# EAGLE design ECE_388_Schematic_v3 (EAGLE 9.6.2)
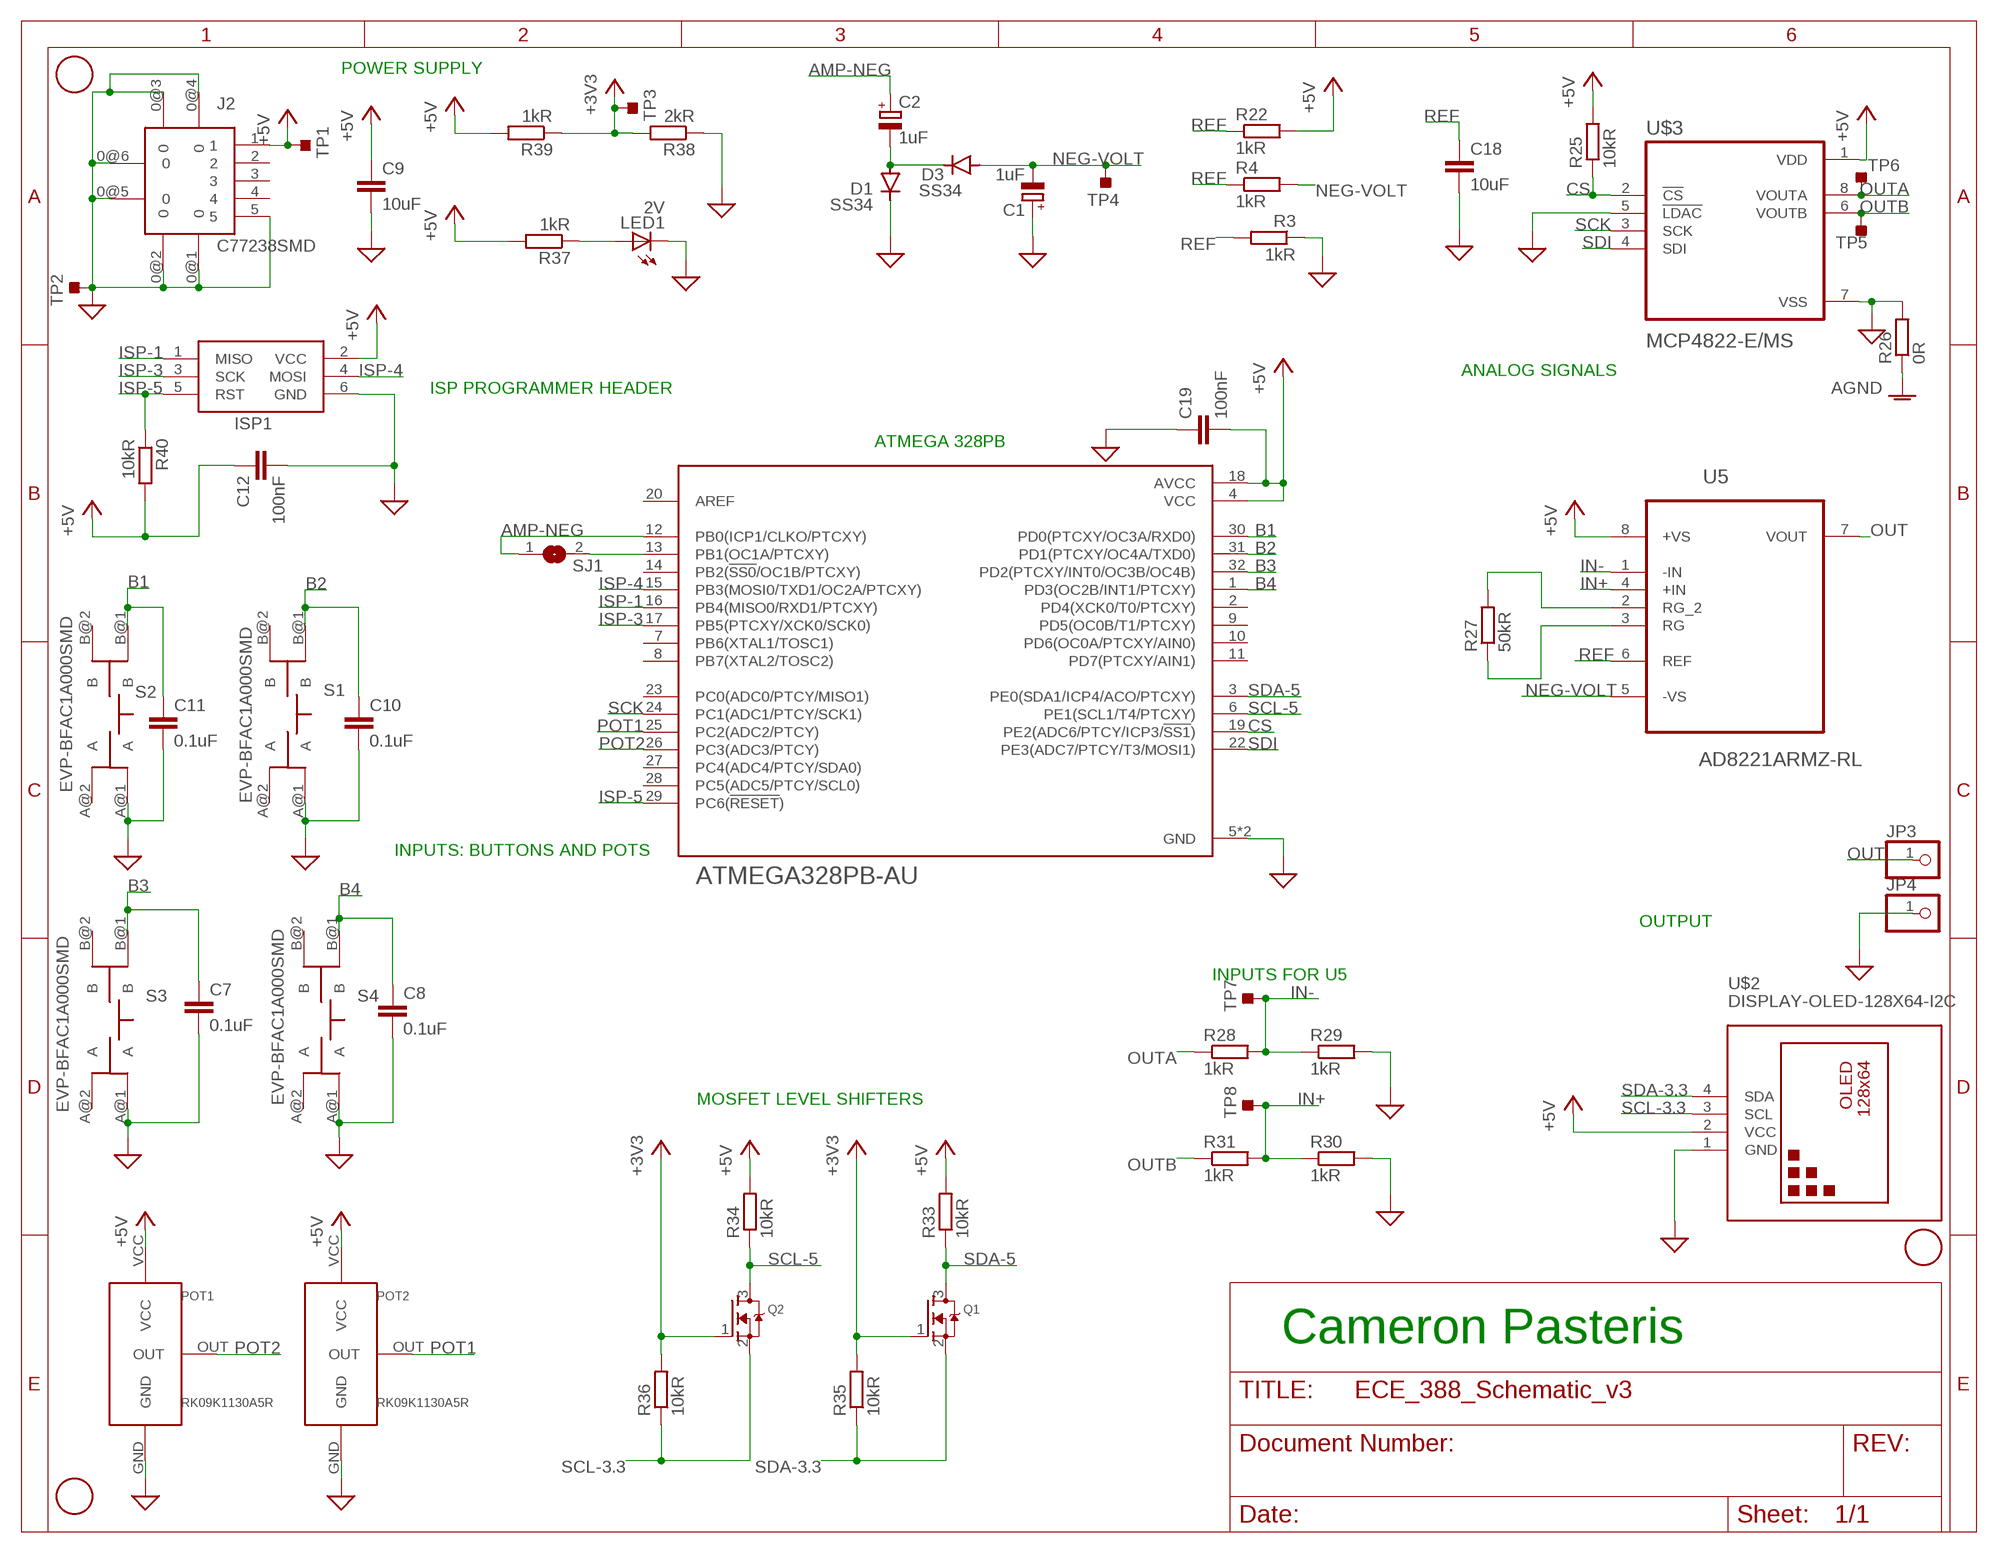
[diagram p0: schematic, sheet 1]

## Parts
C1  1uF  CPOL-EUE2,5-6E  [E2,5-6E]
C2  1uF  CPOL-EUE2,5-6E  [E2,5-6E]
C7  0.1uF  C-EUC0805  [C0805]
C8  0.1uF  C-EUC0805  [C0805]
C9  10uF  C-EUC0805  [C0805]
C10  0.1uF  C-EUC0805  [C0805]
C11  0.1uF  C-EUC0805  [C0805]
C12  100nF  C-EUC0805  [C0805]
C18  10uF  C-EUC0805  [C0805]
C19  100nF  C-EUC0805  [C0805]
D1  SS34  DIODE-DO-214AC  [DO-214AC]
D3  SS34  DIODE-DO-214AC  [DO-214AC]
F1  FIDUCIAL  [FIDUCIAL_1MM]
F2  FIDUCIAL  [FIDUCIAL_1MM]
F3  FIDUCIAL  [FIDUCIAL_1MM]
ISP1  AVRISP-6  [AVRISP]
J2  C77238SMD  [C77238]
JP3  PINHD-1X1  [1X01]
JP4  PINHD-1X1  [1X01]
LED1  2V  LEDCHIP-LED0805  [CHIP-LED0805]
POT1  RK09K1130A5R  [RK09K1130A5R]
POT2  RK09K1130A5R  [RK09K1130A5R]
Q1  MOSFET-NREFLOW  [SOT23]
Q2  MOSFET-NREFLOW  [SOT23]
R3  1kR  R-EU_R0805  [R0805]
R4  1kR  R-EU_R0805  [R0805]
R22  1kR  R-EU_R0805  [R0805]
R25  10kR  R-EU_R0805  [R0805]
R26  0R  R-EU_R0805  [R0805]
R27  50kR  R-EU_R0805  [R0805]
R28  1kR  R-EU_R0805  [R0805]
R29  1kR  R-EU_R0805  [R0805]
R30  1kR  R-EU_R0805  [R0805]
R31  1kR  R-EU_R0805  [R0805]
R33  10kR  R-EU_R0805  [R0805]
R34  10kR  R-EU_R0805  [R0805]
R35  10kR  R-EU_R0805  [R0805]
R36  10kR  R-EU_R0805  [R0805]
R37  1kR  R-EU_R0805  [R0805]
R38  2kR  R-EU_R0805  [R0805]
R39  1kR  R-EU_R0805  [R0805]
R40  10kR  R-EU_R0805  [R0805]
S1  EVP-BFAC1A000SMD  [EVP-BFAC1A000]
S2  EVP-BFAC1A000SMD  [EVP-BFAC1A000]
S3  EVP-BFAC1A000SMD  [EVP-BFAC1A000]
S4  EVP-BFAC1A000SMD  [EVP-BFAC1A000]
SJ1  SJ  [SJ]
TP1  TESTPOINT_TPS-PAD-036  [TESTPOINT_PAD-036]
TP2  TESTPOINT_TPS-PAD-036  [TESTPOINT_PAD-036]
TP3  TESTPOINT_TPS-PAD-036  [TESTPOINT_PAD-036]
TP4  TESTPOINT_TPS-PAD-036  [TESTPOINT_PAD-036]
TP5  TESTPOINT_TPS-PAD-036  [TESTPOINT_PAD-036]
TP6  TESTPOINT_TPS-PAD-036  [TESTPOINT_PAD-036]
TP7  TESTPOINT_TPS-PAD-036  [TESTPOINT_PAD-036]
TP8  TESTPOINT_TPS-PAD-036  [TESTPOINT_PAD-036]
U1  ATMEGA328PB-AU  [QFP80P900X900X120-32N]
U5  AD8221ARMZ-RL  [SOP65P490X110-8N]
U$2  DISPLAY-OLED-128X64-I2C  [DISPLAY-OLED-128X64-I2C]
U$3  MCP4822-E/MS  [SOP65P490X110-8N]

## Nets
+3V3: Q1.1(G) Q2.1(G) R35.2 R36.2 R38.2 R39.1 TP3.1(TP)
+5V: C9.1 C12.1 C19.2 ISP1.2(VCC) J2.1 POT1.VCC POT2.VCC R22.2 R25.2 R33.2 R34.2 R37.2 R39.2 R40.2 TP1.1(TP) U1.4(VCC) U1.18(AVCC) U5.8(+VS) U$2.2(VCC) U$3.1(VDD)
AGND: R26.1
AMP-NEG: C2.+ SJ1.1 U1.12(PB0(ICP1/CLKO/PTCXY))
B1: C11.1 S2.B@1(B) U1.30(PD0(PTCXY/OC3A/RXD0))
B2: C10.1 S1.B@1(B) U1.31(PD1(PTCXY/OC4A/TXD0))
B3: C7.1 S3.B@1(B) U1.32(PD2(PTCXY/INT0/OC3B/OC4B))
B4: C8.1 S4.B@1(B) U1.1(PD3(OC2B/INT1/PTCXY))
CS: R25.1 U1.19(PE2(ADC6/PTCY/ICP3/!SS1!)) U$3.2(!CS)
GND: C1.+ C7.2 C8.2 C9.2 C10.2 C11.2 C12.2 C18.2 C19.1 D1.C ISP1.6(GND) J2.0@1 J2.0@2 J2.0@3 J2.0@4 J2.0@5 J2.0@6 J2.5 JP4.1 LED1.C POT1.GND POT2.GND R3.1 R26.2 R29.2 R30.2 R38.1 S1.A@1(A) S2.A@1(A) S3.A@1(A) S4.A@1(A) TP2.1(TP) U1.5(GND) U1.21(GND) U$2.1(GND) U$3.5(!LDAC) U$3.7(VSS) ; supply symbol labelled SUP
IN+: R30.1 R31.2 TP8.1(TP) U5.4(+IN)
IN-: R28.2 R29.1 TP7.1(TP) U5.1(-IN)
ISP-1: ISP1.1(MISO) U1.16(PB4(MISO0/RXD1/PTCXY))
ISP-3: ISP1.3(SCK) U1.17(PB5(PTCXY/XCK0/SCK0))
ISP-4: ISP1.4(MOSI) U1.15(PB3(MOSI0/TXD1/OC2A/PTCXY))
ISP-5: ISP1.5(RST) R40.1 U1.29(PC6(!RESET!))
N$1: R27.2 U5.2(RG_2)
N$2: LED1.A R37.1
N$3: R27.1 U5.3(RG)
N$4: C2.- D1.A D3.C
N$5: SJ1.2 U1.13(PB1(OC1A/PTCXY))
NEG-VOLT: C1.- D3.A R4.2 TP4.1(TP) U5.5(-VS)
OUT: JP3.1 U5.7(VOUT)
OUTA: R28.1 TP6.1(TP) U$3.8(VOUTA)
OUTB: R31.1 TP5.1(TP) U$3.6(VOUTB)
POT1: POT2.OUT U1.25(PC2(ADC2/PTCY))
POT2: POT1.OUT U1.26(PC3(ADC3/PTCY))
REF: C18.1 R3.2 R4.1 R22.1 U5.6(REF)
SCK: U1.24(PC1(ADC1/PTCY/SCK1)) U$3.3(SCK)
SCL-3.3: Q2.2(S) R36.1 U$2.3(SCL)
SCL-5: Q2.3(D) R34.1 U1.6(PE1(SCL1/T4/PTCXY))
SDA-3.3: Q1.2(S) R35.1 U$2.4(SDA)
SDA-5: Q1.3(D) R33.1 U1.3(PE0(SDA1/ICP4/ACO/PTCXY))
SDI: U1.22(PE3(ADC7/PTCY/T3/MOSI1)) U$3.4(SDI)
Unconnected: J2.2 J2.3 J2.4 S1.A@2(A) S1.B@2(B) S2.A@2(A) S2.B@2(B) S3.A@2(A) S3.B@2(B) S4.A@2(A) S4.B@2(B) U1.2(PD4(XCK0/T0/PTCXY)) U1.7(PB6(XTAL1/TOSC1)) U1.8(PB7(XTAL2/TOSC2)) U1.9(PD5(OC0B/T1/PTCXY)) U1.10(PD6(OC0A/PTCXY/AIN0)) U1.11(PD7(PTCXY/AIN1)) U1.14(PB2(!SS0!/OC1B/PTCXY)) U1.20(AREF) U1.23(PC0(ADC0/PTCY/MISO1)) U1.27(PC4(ADC4/PTCY/SDA0)) U1.28(PC5(ADC5/PTCY/SCL0))

## Notes on the sheet
- POWER SUPPLY
- ANALOG SIGNALS
- ISP PROGRAMMER HEADER
- ATMEGA 328PB
- INPUTS: BUTTONS AND POTS
- OUTPUT
- INPUTS FOR U5
- MOSFET LEVEL SHIFTERS
- Cameron Pasteris

## Library data of the parts
C1 C2 = rcl:CPOL-EU: POLARIZED CAPACITOR, European symbol; SPICEPREFIX: C
C7-C12 C18 C19 = rcl:C-EU: CAPACITOR, European symbol; SPICEPREFIX: C
D1 D3 = diode:DIODE-: DIODE
F1-F3 = ECE388:FIDUCIAL: For use by pick and place machines to calibrate the vision/machine, 1mm By microbuilder.eu
ISP1 = adafruit:AVRISP: AVR ISP HEADER Standard 6 pin header for AVR programming
J2 = ECE_388_Custom_Parts_Cameron_Pasteris:C77238: Micro USB connector with part number C77328
JP3 JP4 = adafruit:PINHD-1X1: Pin header 1x1 for 0.1" spacing With round pins
LED1 = adafruit:LED: LED OSRAM: - CHIPLED LG R971, LG N971, LY N971, LG Q971, LY Q971, LO R971, LY R971 LH N974, LH R974 LS Q976, LO Q976, LY Q976 LO Q996 - Hyper CHIPLED LW Q18S LB Q993, LB Q99A, LB R99A - SideLED LS A670, LO A670, LY A670, LG A670, LP A670 LB A673, LV A673, LT A673, LW A673 LH A674 LY A675 LS A676, LA A676, LO A676, LY A676, LW A676 LS A679, LY A679, LG A679 - Hyper Micro SIDELED® LS Y876, LA Y876, LO Y876, LY Y876 LT Y87S - SmartLED LW L88C, LW L88S LB L89C, LB L89S, LG L890 LS L89K, LO L89K, LY L89K LS L896, LA L896, LO L896, LY L896 - TOPLED LS T670, LO T670, LY T670, LG T670, LP T670 LSG T670, LSP T670, LSY T670, LOP T670, LYG T670 LG T671, LOG T671, LSG T671 LB T673, LV T673, LT T673, LW T673 LH T674 LS T676, LA T676, LO T676, LY T676, LB T676, LH T676, LSB T676, LW T676 LB T67C, LV T67C, LT T67C, LS T67K, LO T67K, LY T67K, LW E67C LS E67B, LA E67B, LO E67B, LY E67B, LB E67C, LV E67C, LT E67C LW T67C LS T679, LY T679, LG T679 LS T770, LO T770, LY T770, LG T770, LP T770 LB T773, LV T773, LT T773, LW T773 LH T774 LS E675, LA E675, LY E675, LS T675 LS T776, LA T776, LO T776, LY T776, LB T776 LHGB T686 LT T68C, LB T68C - Hyper Mini TOPLED® LB M676 - Mini TOPLED Santana® LG M470 LS M47K, LO M47K, LY M47K Source: http://www.osram.convergy.de/
POT1 POT2 = RK09K1130A5R:RK09K1130A5R
Q1 Q2 = adafruit:MOSFET-N: N-Channel Mosfet 2N7002E - 60V 260mA SOT23 [Digikey: 2N7002ET1GOSTR-ND] - REEL BSH103 - 30V 850mA SOT23 [Digikey: 568-5013-1-ND]
R3 R4 R22 R25-R31 R33-R40 = rcl:R-EU_: RESISTOR, European symbol; SPICEPREFIX: R
S1-S4 = ECE_388_Custom_Parts_Cameron_Pasteris:EVP-BFAC1A000
SJ1 = ECE388:SJ: SMD solder JUMPER
TP1-TP8 = 52101-101-REV-A_v16:TESTPOINT_TPS: TEST POINT PAD; BOM: EXCLUDE
U1 = ATMEGA328PB-AU:ATMEGA328PB-AU: ATmega Series 20 MHz 32 KB Flash 2 KB SRAM 8-Bit Microcontroller - TQFP-32 Check prices <https://pricing.snapeda.com/search/part/ATMEGA328PB-AU/?ref=eda>; AVAILABILITY: Good; DESCRIPTION: 8-bit Microcontrollers - MCU ATMEGA328PB 20MHZ IND TEMP; MF: Microchip Technology / Atmel; MP: ATMEGA328PB-AU; PACKAGE: None; PRICE: None; PURCHASE-URL: https://pricing.snapeda.com/search/part/ATMEGA328PB-AU/?ref=eda
U5 = AD8221ARMZ-RL:AD8221ARMZ-RL: Precision Instrumentation Amplifier Check prices <https://pricing.snapeda.com/search/part/AD8221ARMZ-RL/?ref=eda>; AVAILABILITY: Warning; DESCRIPTION: Instrumentation Amplifier 1 Circuit 8-MSOP; MF: Analog Devices; MP: AD8221ARMZ-RL; PACKAGE: MSOP-8 Analog Devices; PRICE: None; PURCHASE-URL: https://pricing.snapeda.com/search/part/AD8221ARMZ-RL/?ref=eda
U$2 = diy-modules:DISPLAY-OLED-128X64-I2C: 128x64 Dot Matrix OLED Module based on SSD1306 chip Variant with I2C interface More details available here: http://www.instructables.com/id/Monochrome-096-i2c-OLED-display-with-arduino-SSD13/ SSD1306 datasheet: https://cdn-shop.adafruit.com/datasheets/SSD1306.pdf Click here to find device on ebay.com <http://www.ebay.com/sch/oled+display+128x64+iic> Note: There are two variants: I2C and SPI. Search for the proper version.
U$3 = MCP4822-E_MS (1):MCP4822-E/MS: Check prices <https://pricing.snapeda.com/parts/MCP4822-E/MS/Microchip/view-part?ref=eda>; AVAILABILITY: Good; DESCRIPTION: 12 Bit Digital to Analog Converter 2 8-MSOP; MF: Microchip; MP: MCP4822-E/MS; PACKAGE: MSOP-8 Microchip; PRICE: None; PURCHASE-URL: https://pricing.snapeda.com/search/part/MCP4822-E/MS/?ref=eda

## Board
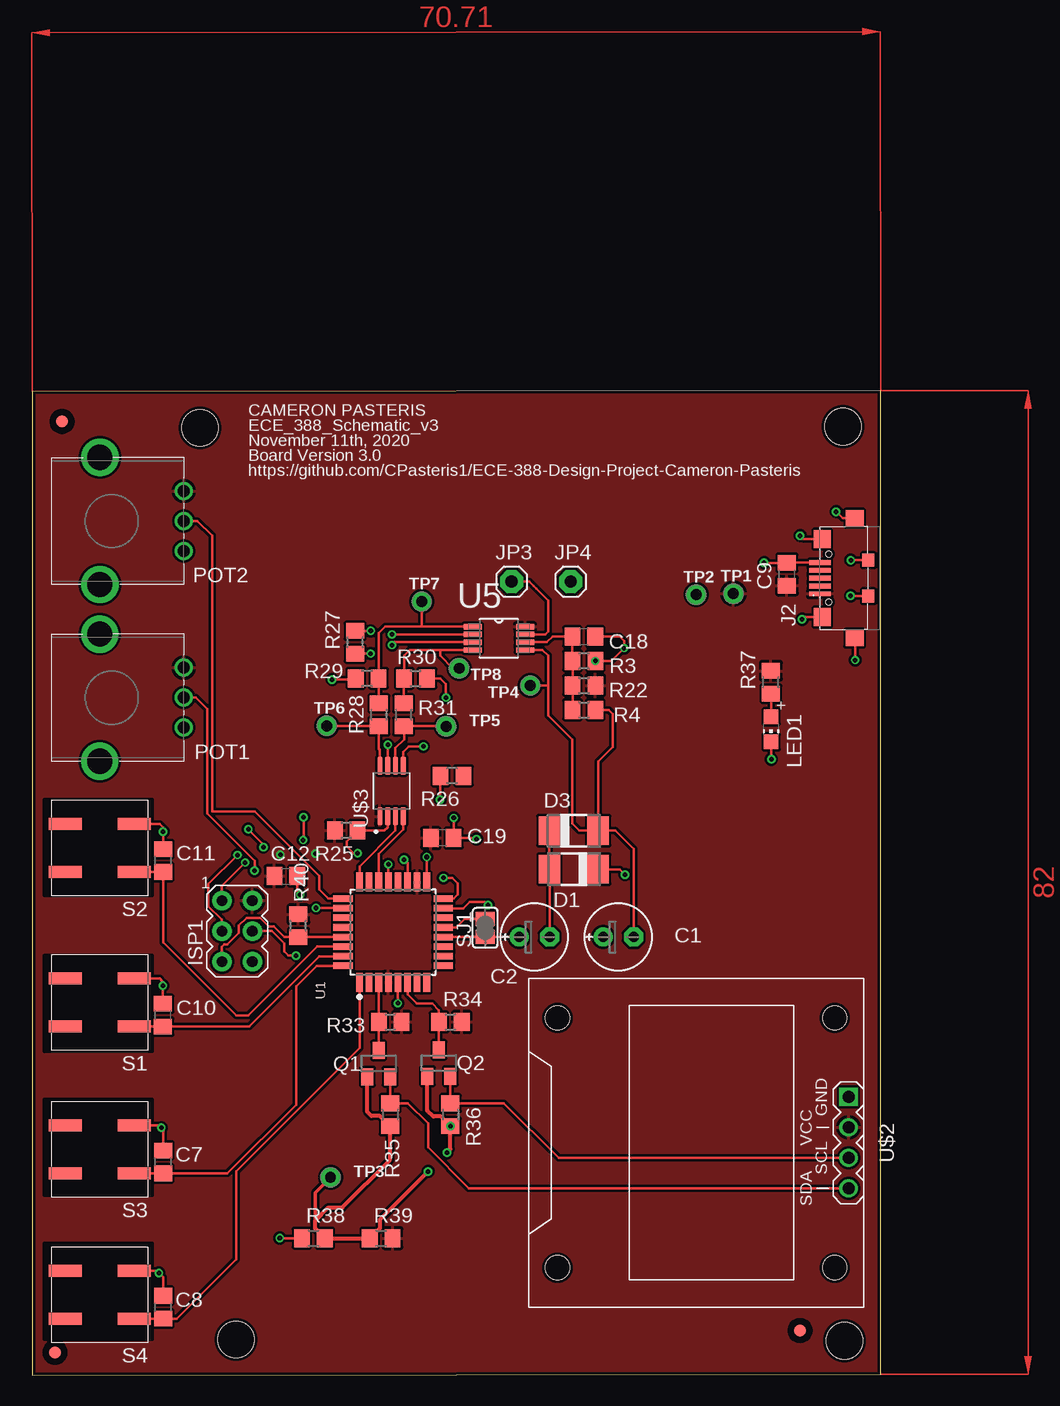
[diagram p1: board, top side]
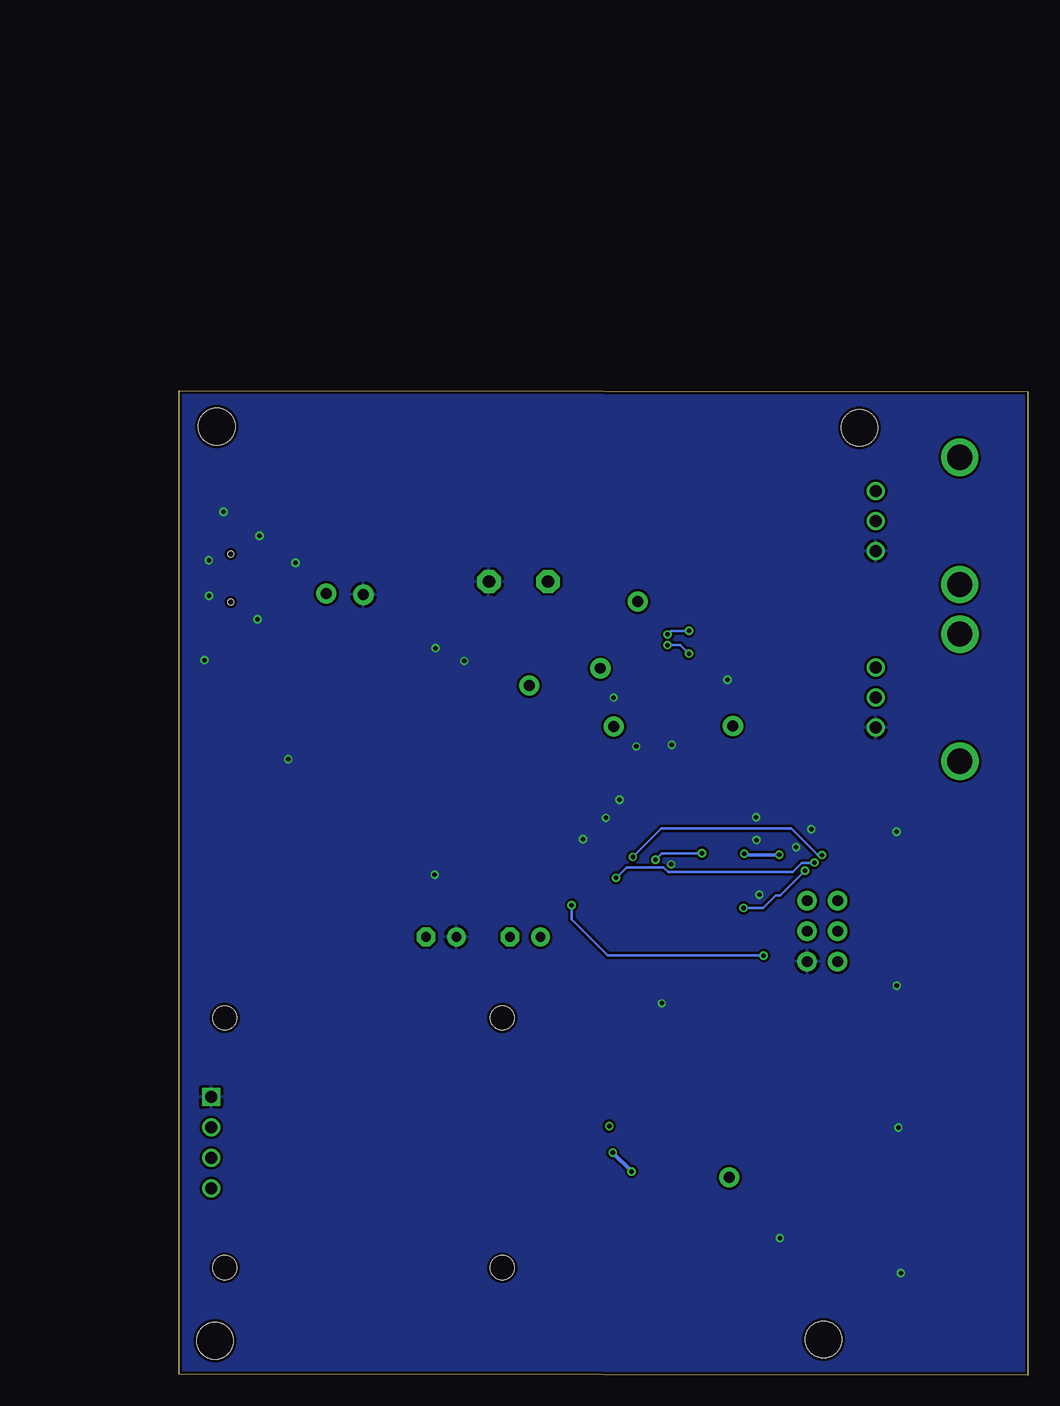
[diagram p2: board, bottom side, seen from below]

Size 70.71 x 82.1 mm. Coordinates in mm from the lower left corner, seen from the top.
Outline: 0,0 70.71,0.1 70.71,82.1 0,82 0,0
Copper layers (1*16): Top 0.035mm / dielectric 1.5mm / Bottom 0.035mm
Design rules "Dirty8TS": minimum track width 8mil, minimum drill 15mil, track to track 8mil, track to pad 8mil, pad to pad 8mil, via to via 8mil, smd to smd 0mil, copper to edge 10mil, drill to drill 10mil, minimum pad ring 10mil, minimum via ring 6mil, stop-mask expansion 2mil, vias tented up to drill 25mil, thermal gap 10mil
Holes 3.05 mm at 14,79 67.57,79.1 17,3 67.71,2.89
tRestrict: 16 lines

### Footprints (pad centres in the part's own frame; a part is rotated, then mirrored left to right if it is on the bottom)
E2,5-6E = drill 0.813 pad 1.575: + -1.27,0 | drill 0.813 pad 1.575 octagon: - 1.27,0
C0805 = smd 1.3 x 1.5: 1 -0.95,0; 2 0.95,0
DO-214AC = smd 1.8 x 2.4: A 2.025,0; C -2.025,0
FIDUCIAL_1MM = smd 1 x 1: 1 0,0
AVRISP = drill 0.9 pad 1.626: 1 -1.27,2.54; 2 1.27,2.54; 3 -1.27,0; 4 1.27,0; 5 -1.27,-2.54; 6 1.27,-2.54
C77238 = smd 1.5 x 1.4: 0@1 3.25,-0.2; 0@4 -3.25,-0.2 | smd 1.35 x 1.5: 0@2 5,-2.9; 0@3 -5,-2.9 | smd 1.1 x 1: 0@5 1.5,-4.05; 0@6 -1.5,-4.05 | smd 0.4 x 1.8: 1 -1.3,0; 2 -0.65,0; 3 0,0; 4 0.65,0; 5 1.3,0 | hole 0.49: -2,-0.75; 2,-0.75
1X01 = drill 1.016 pad 1.93 octagon: 1 0,0
CHIP-LED0805 = smd 1.2 x 1.2: A 0,-1.05; C 0,1.05
RK09K1130A5R = drill 2.1: 1 -5.3,7; 2 5.3,7 | drill 1: GND -2.5,0; OUT 0,0; VCC 2.5,0
SOT23 = smd 1 x 1.4: 1 -0.95,-1.1; 2 0.95,-1.1; 3 0,1.1
R0805 = smd 1.3 x 1.5: 1 -0.95,0; 2 0.95,0
EVP-BFAC1A000 = smd 2.75 x 1: A@1 -2.875,-2; A@2 2.875,-2; B@1 -2.875,2; B@2 2.875,2
SJ = smd 1.168 x 1.6: 1 -0.762,0; 2 0.762,0
TESTPOINT_PAD-036 = drill 0.914 pad 1.676: 1 0,0
QFP80P900X900X120-32N = smd 1.6 x 0.55: 1 -4.18,2.8; 2 -4.18,2; 3 -4.18,1.2; 4 -4.18,0.4; 5 -4.18,-0.4; 6 -4.18,-1.2; 7 -4.18,-2; 8 -4.18,-2.8; 17 4.18,-2.8; 18 4.18,-2; 19 4.18,-1.2; 20 4.18,-0.4; 21 4.18,0.4; 22 4.18,1.2; 23 4.18,2; 24 4.18,2.8 | smd 0.55 x 1.6: 9 -2.8,-4.18; 10 -2,-4.18; 11 -1.2,-4.18; 12 -0.4,-4.18; 13 0.4,-4.18; 14 1.2,-4.18; 15 2,-4.18; 16 2.8,-4.18; 25 2.8,4.18; 26 2,4.18; 27 1.2,4.18; 28 0.4,4.18; 29 -0.4,4.18; 30 -1.2,4.18; 31 -2,4.18; 32 -2.8,4.18
SOP65P490X110-8N = smd 1.499 x 0.432: 1 -2.184,0.965; 2 -2.184,0.33; 3 -2.184,-0.33; 4 -2.184,-0.965; 5 2.184,-0.965; 6 2.184,-0.33; 7 2.184,0.33; 8 2.184,0.965
DISPLAY-OLED-128X64-I2C = drill 1 square: 1 -3.81,12.7 | drill 1: 2 -1.27,12.7; 3 1.27,12.7; 4 3.81,12.7 | hole 2: -10.414,11.557; 10.414,11.557; 10.414,-11.557; -10.414,-11.557
SOP65P490X110-8N' = smd 1.5 x 0.445: 1 -2.105,0.975; 2 -2.105,0.325; 3 -2.105,-0.325; 4 -2.105,-0.975; 5 2.105,-0.975; 6 2.105,-0.325; 7 2.105,0.325; 8 2.105,0.975

### Placement (x,y rotation side)
C1  48.86,36.55 0 top
C2  41.86,36.55 0 top
C7  10.93,17.8 90 top
C8  10.92,5.69 90 top
C9  62.91,66.79 90 top
C10  10.91,30.03 90 top
C11  10.92,42.92 90 top
C12  21.15,41.62 0 top
C18  45.98,61.59 0 top
C19  34.18,44.8 180 top
D1  45.15,42.2 180 top
D3  45.14,45.41 0 top
F1  64,3.74 0 top
F2  1.91,1.92 0 top
F3  2.5,79.52 0 top
ISP1  17.09,37.04 0 top
J2  65.65,66.46 90 top
JP3  39.96,66.17 0 top
JP4  44.88,66.17 0 top
LED1  61.59,53.86 180 top
POT1  12.64,56.5 90 top
POT2  12.65,71.23 90 top
Q1  28.89,26 0 top
Q2  33.9,26.04 0 top
R3  45.99,59.56 180 top
R4  45.99,55.48 0 top
R22  45.99,57.52 0 top
R25  26.18,45.42 180 top
R26  35,49.99 180 top
R27  26.93,61.12 90 top
R28  28.91,55.07 90 top
R29  27.92,58.1 180 top
R30  31.96,58.1 0 top
R31  30.97,55.07 90 top
R33  29.85,29.47 0 top
R34  34.86,29.47 0 top
R35  29.84,21.73 270 top
R36  34.86,21.73 270 top
R37  61.56,57.79 90 top
R38  23.44,11.44 0 top
R39  29.09,11.44 0 top
R40  22.19,37.49 90 top
S1  5.64,31.09 180 top
S2  5.65,43.96 180 top
S3  5.66,18.85 180 top
S4  5.65,6.74 180 top
SJ1  37.76,37.31 90 top
TP1  58.45,65.17 0 top
TP2  55.34,65.08 0 top
TP3  24.87,16.52 0 top
TP4  41.52,57.52 0 top
TP5  34.5,54.11 0 top
TP6  24.55,54.15 0 top
TP7  32.47,64.52 0 top
TP8  35.59,58.95 0 top
U1  30.09,36.95 90 top
U5  38.9,61.45 0 top
U$2  55.34,19.4 270 top
U$3  MCP4822-E/MS  [SOP65P490X110-8N']  29.96,48.72 90 top

### Tracks (layer width: path | path; a pad name or v marks a point on that pad's centre or on a via)
+3V3  (via drill 0.38)
  Top 0.305: TP3.1 23.58,15.23 23.58,12.88
  Top 0.35: v33,17 29,13 29,12.3 R39.1 R38.2 23.58,12.25 23.58,12.88 24.7,14 25.86,14 29.84,17.98 R35.2 28.99,21.63 28.27,21.63 27.94,21.96 Q1.1 | v34.57,18.57 34.86,18.86 R36.2 34.06,21.58 33.44,21.58 32.95,22.07 Q2.1
  Bottom 0.35: v33,17 v34.57,18.57
  other vias: 34.86,20.78
+5V  (via drill 0.38)
  Top 0.35: J2.1
  Bottom 0.305: v20.69,43.4 23.51,43.4 v23.61,43.5
  pour Top: 0,82 71,82 71,0 0,0
AMP-NEG
  Top 0.203: U1.12 SJ1.1 C2.+
B1
  Top 0.203: S2.B@1 C11.1 10.92,36.08 17,30 18,30 23.75,35.75 U1.30
B2
  Top 0.203: S1.B@1 C10.1 18.08,29.08 23.95,34.95 U1.31
B3
  Top 0.203: S3.B@1 C7.1 16.27,16.85 22,22.58 22,32.42 23.73,34.15 U1.32
B4
  Top 0.203: S4.B@1 C8.1 12.07,4.74 17,9.67 17,17 27.29,27.29 U1.1
CS  (via drill 0.38)
  Top 0.203: U1.19 31.29,42.71 v31,43 | U$3.2 29.64,45.7 29.36,45.42 R25.1 26.24,44.53 26.24,44.08 26.79,43.53 v27.13,43.53
  Bottom 0.203: v27.13,43.53 30.47,43.53 v31,43
GND  (via drill 0.38)
  Top 0.203: U1.21 v29.69,42.6 | J2.5 62.93,67.76 C9.2 v61,67.74 | v64,70 64.29,69.71 J2.0@1 | J2.0@2 67.54,71.46 v67,72 | J2.0@5 v68.23,67.96 | J2.0@6 68.24,64.96 v68.21,64.99 | J2.0@3 68.59,61.42 v68.59,59.63 | J2.0@4 64.35,63.21 v64.17,63.03 | LED1.C 61.61,52.79 v61.61,51.37 | U$3.5 30.93,51.97 31.41,52.44 v32.61,52.44 | U$3.7 29.65,50.84 v29.65,52.57 | R29.2 26.87,58 v25,58 | R30.2 34.02,58.1 34.49,57.63 v34.49,56.51 | v37.04,44.71 36.95,44.8 C19.1 v35.14,46.48 | U1.5 v30.49,31.03 v30.48,31.02 | v18.02,45.53 19.28,44.27 v19.28,44.04 | v22.62,46.54 22.62,44.66 v22.59,44.63 | R38.1 v20.64,11.45 | C18.2 48.98,61.59 49.34,61.23 v49.34,60.63 48.27,59.56 R3.1 | S2.A@1 10.64,45.96 10.92,45.68 v10.92,45.33 v10.93,45.32 C11.2 | v49.41,41.75 48.96,42.2 D1.C | C12.2 22.1,40.33 v22.35,40.08 | S1.A@1 10.63,33.09 10.9,32.82 v10.9,32.49 v10.91,32.48 C10.2 | S3.A@1 10.57,20.85 v10.77,20.65 10.93,20.49 C7.2 | S4.A@1 10.35,8.74 v10.56,8.53 10.92,8.17 C8.2 | v34,48 34,49.94 R26.2
  other vias: 46.94,59.56
  pour Bottom: 0,82 70.63,82 70.66,81.97 70.66,0.14 70.67,0.13 0.05,0.13 0.05,81.95
IN+
  Top 0.203: R31.2 30.97,58.06 R30.1 31,60 31.48,60.48 34,60.48 | U5.4 34,60.48 | 34,60.48 34,60 35.05,58.95 TP8.1
IN-
  Top 0.203: R28.2 28.91,58.06 R29.1 28.87,61.87 29.41,62.42 32.47,62.42 | U5.1 32.47,62.42 | TP7.1 32.47,62.42
ISP-1  (via drill 0.38)
  Top 0.203: ISP1.1 15.82,40.82 v17.75,42.76 | U1.16 35.14,39.75 35.49,40.1 35.49,41 35.01,41.48 v34.29,41.48
  Bottom 0.203: v34.29,41.48 33.42,42.35 30.36,42.35 29.96,41.95 19.58,41.95 18.81,42.73 17.78,42.73 v17.75,42.76
ISP-3  (via drill 0.38)
  Top 0.203: ISP1.3 15.82,38 14.7,39.12 14.7,40.96 v17.13,43.38 | v32.89,43.22 U1.17
  Bottom 0.203: v17.13,43.38 17.47,43.38 19.67,45.59 30.52,45.59 v32.89,43.22
ISP-4  (via drill 0.38)
  Top 0.203: ISP1.4 19.96,37.04 21,36 21,35.35 21.35,35 v22,35 | v38,39.2 37.73,39.47 36.47,39.47 35.95,38.95 U1.15
  Bottom 0.203: v22,35 35,35 38,38 v38,39.2
ISP-5
  Top 0.203: ISP1.5 15.82,35.74 16,35.92 16.28,35.92 17.24,36.88 17.24,37.5 17.9,38.16 19,38.16 19.71,37.45 20.13,37.45 21.04,36.54 R40.1 U1.29
N$1  (via drill 0.38)
  Top 0.203: R27.2 v28.22,62.07 | v30,61.77 30.01,61.78 U5.2
  Bottom 0.203: v28.22,62.07 29.7,62.07 v30,61.77
N$2
  Top 0.203: R37.1 61.59,56.81 LED1.A
N$3  (via drill 0.38)
  Top 0.203: R27.1 v28.22,60.17 | v30,60.88 30.24,61.12 U5.3
  Bottom 0.203: v28.22,60.17 28.93,60.88 v30,60.88
N$4
  Top 0.203: C2.- D1.A D3.C
N$5
  Top 0.203: U1.13 35.35,37.35 36.07,38.07 SJ1.2
NEG-VOLT
  Top 0.203: C1.- 50.13,43.87 48.59,45.41 D3.A | D3.A 45.59,45.41 45,46 45,53 43,55 43,57.52 | 41,60.4 U5.5 42.52,60.48 43,60 43,57.52 | R4.2 48.04,55.48 48.38,55.14 48.38,52.38 47.16,51.16 D3.A | TP4.1 43,57.52
OUT
  Top 0.203: U5.7 42.78,61.78 43,62 43,64.6 42,65.6 41.8,65.8 41.43,66.17 JP3.1
OUTA
  Top 0.203: U$3.8 28.98,52.16 28.91,52.24 R28.1 27,54.12 24.58,54.12 TP6.1
OUTB
  Top 0.203: U$3.6 30.29,52.28 31,53 31,54.09 R31.1 TP5.1
POT1
  Top 0.203: POT2.OUT 13.77,71.23 15,70 15,47 18.57,47 23.92,41.65 23.92,40.53 24.7,39.75 U1.25
POT2  (via drill 0.38)
  Top 0.203: POT1.OUT 13.66,56.5 14.59,55.57 14.59,46.83 18.54,42.88 v18.54,42.08 | v23.67,38.97 25.89,38.97 U1.26
  Bottom 0.203: v23.67,38.97 22.03,38.97 21,40 20.62,40 v18.54,42.08
REF
  Top 0.203: R4.1 R22.1 R3.2 C18.1 43.38,61.59 42.91,61.12 U5.6
SCK
  Top 0.203: U1.24 27.29,42.45 30.29,45.45 U$3.3
SCL-3.3
  Top 0.203: Q2.2 R36.1 39.32,22.68 43.87,18.13 U$2.3
SCL-5
  Top 0.203: U1.6 31.29,31.75 32.04,31 33.36,31 33.91,30.45 R34.1 Q2.3
SDA-3.3
  Top 0.203: Q1.2 R35.1 31.32,22.68 33,21 33,19 36.41,15.59 U$2.4
SDA-5
  Top 0.203: U1.3 R33.1 Q1.3
SDI
  Top 0.203: U1.22 28.89,42 28.89,42.13 28.89,43.48 30.93,45.52 U$3.4
(copper drawn outside any net)
  shapes: Top area x2

### Text on the board
tPlace: CAMERON PASTERIS | ECE_388_Schematic_v3 | November 11th, 2020 | Board Version 3.0 | https://github.com/CPasteris1/ECE-388-Design-Project-Cameron-Pasteris